# EAGLE design max21100_v3 (EAGLE 6.5.0)
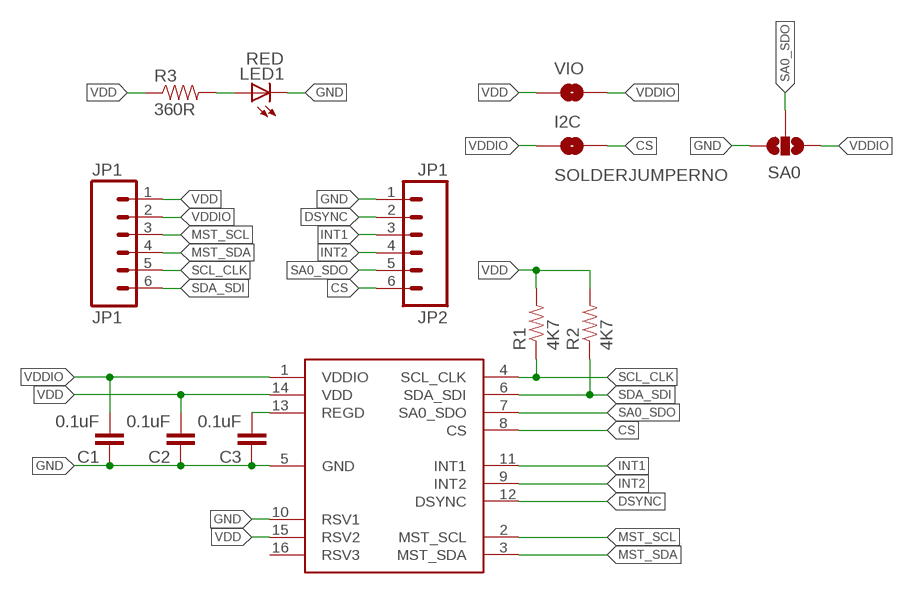
[diagram p0: schematic, sheet 1]

## Parts
C1  0.1uF  CAP0603-CAP  [0603-CAP]
C2  0.1uF  CAP0603-CAP  [0603-CAP]
C3  0.1uF  CAP0603-CAP  [0603-CAP]
I2C  SOLDERJUMPERNO  [SJ_2S-NO]
JP1  JP1  M06SIP  [1X06]
JP2  JP1  M06SIP  [1X06]
LED1  RED  LEDCHIP-LED0603  [CHIP-LED0603]
R1  4K7  RESISTOR0603-RES  [0603-RES]
R2  4K7  RESISTOR0603-RES  [0603-RES]
R3  360R  RESISTOR0603-RES  [0603-RES]
SA0  SOLDERJUMPER_2WAYS  [SJ_3]
U$1  MAX21100  [MAX21100]
VIO  SOLDERJUMPERTRACE  [SJ_2S-TRACE]

## Nets
CS: I2C.2 JP2.6 U$1.8(CS)
DSYNC: JP2.2 U$1.12(DSYNC)
GND [thin]: C1.1 C2.1 C3.1 JP2.1 LED1.C SA0.1 U$1.5(GND) U$1.10(RSV1)
INT1: JP2.3 U$1.11(INT1)
INT2: JP2.4 U$1.9(INT2)
MST_SCL: JP1.3 U$1.2(MST_SCL)
MST_SDA: JP1.4 U$1.3(MST_SDA)
N$1: LED1.A R3.2
REGD: C3.2 U$1.13(REGD)
SA0_SDO: JP2.5 SA0.2 U$1.7(SA0_SDO)
SCL_CLK: JP1.5 R1.1 U$1.4(SCL_CLK)
SDA_SDI: JP1.6 R2.1 U$1.6(SDA_SDI)
VDD: C2.2 JP1.1 R1.2 R2.2 R3.1 U$1.14(VDD) U$1.15(RSV2) VIO.1
VDDIO: C1.2 I2C.1 JP1.2 SA0.3 U$1.1(VDDIO) VIO.2
Unconnected: U$1.16(RSV3)

## Library data of the parts
C1-C3 = SparkFun-Passives:CAP: Capacitor Standard 0603 ceramic capacitor, and 0.1" leaded capacitor.
I2C VIO = max21100:SOLDERJUMPER: Solder Jumper Standard SMD solder jumper. Used to automate production. Two varients : Normally Open and Normally Closed are the same, but have different paste layers. NC will have a large amount of paste and should jumper during reflow.
JP1 JP2 = max21100:M06: Header 6 Standard 6-pin 0.1" header. Use with straight break away headers (SKU : PRT-00116), right angle break away headers (PRT-00553), swiss pins (PRT-00743), machine pins (PRT-00117), and female headers (PRT-00115). Molex polarized connector foot print use with SKU : PRT-08094 with associated crimp pins and housings. NOTES ON THE VARIANTS LOCK and LOCK_LONGPADS... This footprint was designed to help hold the alignment of a through-hole component (i.e. 6-pin header) while soldering it into place. You may notice that each hole has been shifted either up or down by 0.005 of an inch from it's more standard position (which is a perfectly straight line). This slight alteration caused the pins (the squares in the middle) to touch the edges of the holes. Because they are alternating, it causes a "brace" to hold the component in place. 0.005 has proven to be the perfect amount of "off-center" position when using our standard breakaway headers. Although looks a little odd when you look at the bare footprint, once you have a header in there, the alteration is very hard to notice. Also,if you push a header all the way into place, it is covered up entirely on the bottom side. This idea of altering the position of holes to aid alignment will be further integrated into the Sparkfun Library for other footprints. It can help hold any component with 3 or more connection pins.
LED1 = breakouts:LED: LED OSRAM: - CHIPLED LG R971, LG N971, LY N971, LG Q971, LY Q971, LO R971, LY R971 LH N974, LH R974 LS Q976, LO Q976, LY Q976 LO Q996 - Hyper CHIPLED LW Q18S LB Q993, LB Q99A, LB R99A - SideLED LS A670, LO A670, LY A670, LG A670, LP A670 LB A673, LV A673, LT A673, LW A673 LH A674 LY A675 LS A676, LA A676, LO A676, LY A676, LW A676 LS A679, LY A679, LG A679 - Hyper Micro SIDELED® LS Y876, LA Y876, LO Y876, LY Y876 LT Y87S - SmartLED LW L88C, LW L88S LB L89C, LB L89S, LG L890 LS L89K, LO L89K, LY L89K LS L896, LA L896, LO L896, LY L896 - TOPLED LS T670, LO T670, LY T670, LG T670, LP T670 LSG T670, LSP T670, LSY T670, LOP T670, LYG T670 LG T671, LOG T671, LSG T671 LB T673, LV T673, LT T673, LW T673 LH T674 LS T676, LA T676, LO T676, LY T676, LB T676, LH T676, LSB T676, LW T676 LB T67C, LV T67C, LT T67C, LS T67K, LO T67K, LY T67K, LW E67C LS E67B, LA E67B, LO E67B, LY E67B, LB E67C, LV E67C, LT E67C LW T67C LS T679, LY T679, LG T679 LS T770, LO T770, LY T770, LG T770, LP T770 LB T773, LV T773, LT T773, LW T773 LH T774 LS E675, LA E675, LY E675, LS T675 LS T776, LA T776, LO T776, LY T776, LB T776 LHGB T686 LT T68C, LB T68C - Hyper Mini TOPLED® LB M676 - Mini TOPLED Santana® LG M470 LS M47K, LO M47K, LY M47K Source: http://www.osram.convergy.de LUXEON: - LUMILED® LXK2-PW12-R00, LXK2-PW12-S00, LXK2-PW14-U00, LXK2-PW14-V00 LXK2-PM12-R00, LXK2-PM12-S00, LXK2-PM14-U00 LXK2-PE12-Q00, LXK2-PE12-R00, LXK2-PE12-S00, LXK2-PE14-T00, LXK2-PE14-U00 LXK2-PB12-K00, LXK2-PB12-L00, LXK2-PB12-M00, LXK2-PB14-N00, LXK2-PB14-P00, LXK2-PB14-Q00 LXK2-PR12-L00, LXK2-PR12-M00, LXK2-PR14-Q00, LXK2-PR14-R00 LXK2-PD12-Q00, LXK2-PD12-R00, LXK2-PD12-S00 LXK2-PH12-R00, LXK2-PH12-S00 LXK2-PL12-P00, LXK2-PL12-Q00, LXK2-PL12-R00 Source: www.luxeon.com KINGBRIGHT: KA-3528ASYC Source: www.kingbright.com
R1-R3 = SparkFun-Passives:RESISTOR: Resistor Basic schematic elements and footprints for 0603, 1206, and PTH resistors.
SA0 = max21100:SOLDERJUMPER_2WAY: Solder Jumper 2 way solder jumper
U$1 = max21100:MAX21100

## Net classes
0 default: width 0.203 mm, clearance 0.152 mm
1 thin: width 0.152 mm

## Board
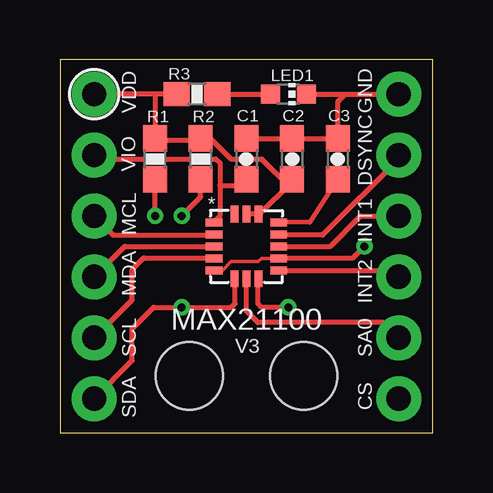
[diagram p1: board, top side]
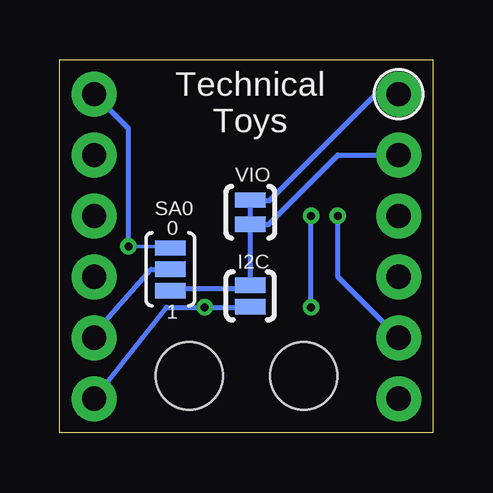
[diagram p2: board, bottom side, seen from below]

Size 15.56 x 15.56 mm. Coordinates in mm from the lower left corner, seen from the top.
Outline: 0,0 15.56,0 15.56,15.56 0,15.56 0,0
Copper layers (1*16): Top 0.0356mm / dielectric 1.5011mm / Bottom 0.0356mm
Design rules "LaenPCBOrder *": minimum track width 6mil, minimum drill 13mil, track to track 6mil, track to pad 6mil, pad to pad 6mil, via to via 6mil, smd to smd 6mil, copper to edge 15mil, drill to drill 6mil, minimum pad ring 7mil, minimum via ring 7mil, stop-mask expansion 2mil, vias tented up to drill 25mil, thermal gap 10mil
Holes 2.8 mm at 10.16,2.38 5.4,2.38

### Footprints (pad centres in the part's own frame; a part is rotated, then mirrored left to right if it is on the bottom)
0603-CAP = smd 1.1 x 1: 1 -0.85,0; 2 0.85,0
SJ_2S-NO = smd 0.635 x 1.27: 1 -0.45,0; 2 0.45,0
1X06 = drill 1.016 pad 1.88: 1 0,0; 2 2.54,0; 3 5.08,0; 4 7.62,0; 5 10.16,0; 6 12.7,0
CHIP-LED0603 = smd 0.8 x 0.8: A 0,-0.75; C 0,0.75
0603-RES = smd 1.1 x 1: 1 -0.85,0; 2 0.85,0
SJ_3 = smd 0.635 x 1.27: 1 -0.889,0; 2 0,0; 3 0.889,0
MAX21100 = smd 0.7 x 0.33: 1 -1.35,1; 2 -1.35,0.5; 3 -1.35,0; 4 -1.35,-0.5; 5 -1.35,-1; 9 1.35,-1; 10 1.35,-0.5; 11 1.35,0; 12 1.35,0.5; 13 1.35,1 | smd 0.33 x 0.7: 6 -0.5,-1.35; 7 0,-1.35; 8 0.5,-1.35; 14 0.5,1.35; 15 0,1.35; 16 -0.5,1.35
SJ_2S-TRACE = smd 0.635 x 1.27: 1 -0.508,0; 2 0.508,0

### Placement (x,y rotation side)
C1  7.78,11.43 270 top
C2  9.68,11.43 270 top
C3  11.59,11.43 270 top
I2C  7.62,5.71 270 bottom
JP1  1.43,14.13 270 top
JP2  14.13,14.13 270 top
LED1  9.53,14.13 270 top
R1  3.97,11.43 90 top
R2  5.87,11.43 90 top
R3  5.71,14.13 0 top
SA0  10.95,6.83 270 bottom
U$1  7.78,7.78 0 top
VIO  7.62,9.21 270 bottom

### Tracks (layer width: path | path; a pad name or v marks a point on that pad's centre or on a via)
CS  (via drill 0.33)
  Top 0.203: v9.53,5.24 8.41,5.24 8.26,5.4 8.26,6.51 U$1.8
  Bottom 0.203: 7.78,5.08 7.78,5.24 | JP2.6 11.11,5.24 v9.53,5.24 7.78,5.24 | 7.78,5.24 I2C.2
DSYNC
  Top 0.203: JP2.2 14.13,11.43 10.95,8.26 9.15,8.26 U$1.12
GND  (via drill 0.33)
  Top 0.152: U$1.10 9.11,7.28 8.41,7.28 8.26,7.14 7.14,7.14 6.78,6.78 U$1.5
  Top 0.203: U$1.10 9.21,7.3 12.22,7.3 v12.7,7.78 | LED1.C 11.91,14.13 | 11.91,14.13 JP2.1 | 11.91,14.13 11.59,13.81 C3.1 C2.1 C1.1
  Bottom 0.152: 10.95,7.46 SA0.1 10.95,7.78 v12.7,7.78
  Bottom 0.203: v12.7,7.78 12.7,12.7 JP2.1
INT1
  Top 0.203: U$1.11 11.27,7.78 12.54,9.05 JP2.3
INT2
  Top 0.203: U$1.9 13.86,6.78 JP2.4
MST_SCL
  Top 0.203: JP1.3 2.22,8.26 6.41,8.26 U$1.2
MST_SDA
  Top 0.203: JP1.4 2.7,7.78 U$1.3
N$1
  Top 0.203: R3.2 LED1.A
REGD
  Top 0.203: C3.2 11.58,10.57 10.43,8.79 U$1.13
SA0_SDO
  Top 0.203: U$1.7 7.78,5.08 8.26,4.6 13.49,4.6 JP2.5
  Bottom 0.203: SA0.2 11.75,6.83 14.13,4.13 JP2.5
SCL_CLK  (via drill 0.33)
  Top 0.203: JP1.5 3.02,5.56 3.02,6.83 3.49,7.3 6.41,7.3 U$1.4 | v3.97,9.05 R1.1
  Bottom 0.203: JP1.5 3.97,6.51 v3.97,9.05
SDA_SDI  (via drill 0.33)
  Top 0.203: JP1.6 3.02,3.02 3.02,4.35 3.91,5.24 v5.08,5.24 7.14,5.24 7.3,5.4 | v5.08,9.05 5.87,9.84 R2.1 | 7.3,5.4 | 7.3,5.4 7.3,6.41 U$1.6
  Bottom 0.203: v5.08,5.24 v5.08,9.05
VDD
  Top 0.203: U$1.15 7.8,9.13 U$1.14 8.41,9.21 9.53,10.32 | 4.92,14.13 R3.1 3.97,14.13 | 3.97,14.13 JP1.1 | 3.97,12.06 3.97,12.22 | 3.97,14.13 R1.2 3.97,12.22 | 3.97,12.22 5.71,12.22 R2.2 5.87,12.22 6.35,12.22 7.14,11.43 8.41,11.43 9.53,10.32 | 9.53,10.32 9.68,10.48 C2.2 9.53,10.32
  Bottom 0.203: 7.78,9.68 6.83,9.68 2.38,14.13 JP1.1
  Bottom 0.406: VIO.1 7.78,9.68
VDDIO
  Top 0.203: 7.46,10.32 7.62,10.48 8.1,10.48 C1.2 7.46,10.32 | JP1.2 1.43,11.43 6.51,11.43 6.67,11.27 6.67,10.32 | 6.67,10.32 6.67,9.05 6.51,8.89 U$1.1 | 6.67,10.32 7.46,10.32
  Bottom 0.203: JP1.2 3.97,11.59 6.86,8.7 VIO.2 I2C.1 7.78,6.03 10.95,6.03 SA0.3

### Text on the board
tPlace: VDD | GND | VIO | DSYNC | MCL | INT1 | MDA | INT2 | MAX21100 | SCL | SA0 | SDA | CS
bPlace: Technical / Toys | 0 | 1
tNames: LED1 | V3